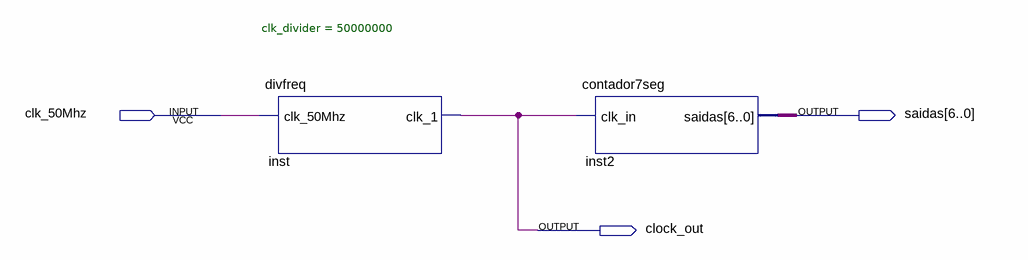
[diagram p0: schematic sheet]
// Quartus schematic counter.bdf as structural Verilog: 2 symbols, 3 pins
module counter (
  input  clk_50Mhz,
  output [6:0] saidas,
  output clock_out
);

  divfreq #(.clk_divider(50000000)) inst (.clk_50Mhz(clk_50Mhz), .clk_1(clock_out));
  contador7seg inst2 (.clk_in(clock_out), .saidas(saidas));
endmodule
